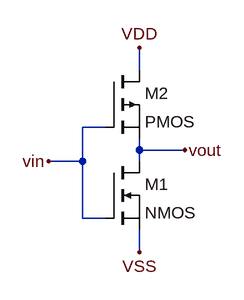
[diagram p0: schematic Inv.asc]
Inv.asc, the LTspice schematic file:
Version 4.1
SHEET 1 880 680
WIRE 160 -80 160 -112
WIRE 112 0 80 0
WIRE 160 32 160 16
WIRE 224 32 160 32
WIRE 80 48 80 0
WIRE 80 48 32 48
WIRE 160 48 160 32
WIRE 80 128 80 48
WIRE 112 128 80 128
WIRE 160 176 160 144
FLAG 32 48 vin
FLAG 224 32 vout
FLAG 160 -112 VDD
FLAG 160 176 VSS
SYMBOL nmos 112 48 R0
SYMATTR InstName M1
SYMBOL pmos 112 -80 R0
SYMATTR InstName M2

The netlist it stands for:
* Inv.asc
M1 vout vin VSS VSS NMOS
M2 VDD vin vout vout PMOS
.model NMOS NMOS
.model PMOS PMOS
.lib standard.mos
.backanno
.end